# EAGLE design passlight (EAGLE 9.5.2)
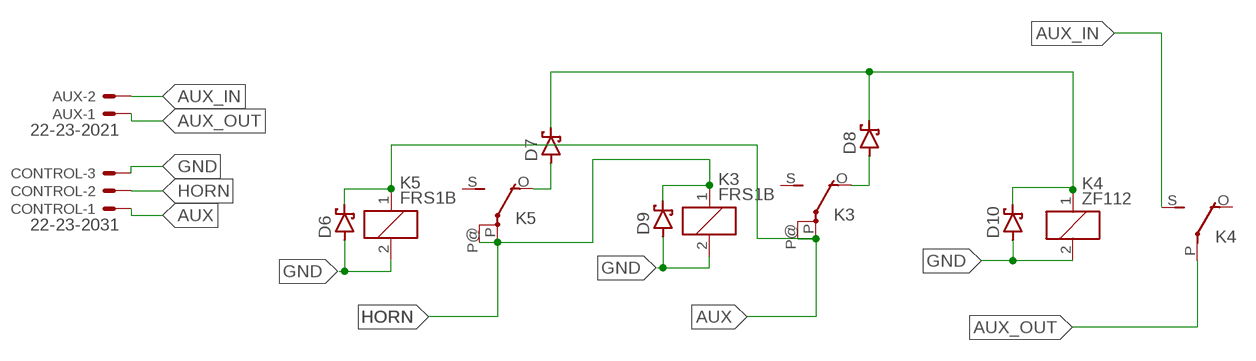
[diagram p0: schematic, sheet 1]

## Parts
AUX  22-23-2021  [22-23-2021]
CONTROL  22-23-2031  [22-23-2031]
D6  SCHOTTKY-DIODESMD  [SMB]
D7  SCHOTTKY-DIODESMD  [SMB]
D8  SCHOTTKY-DIODESMD  [SMB]
D9  SCHOTTKY-DIODESMD  [SMB]
D10  SCHOTTKY-DIODESMD  [SMB]
K3  FRS1B  [FRS1B]
K4  ZF112  [ZF112]
K5  FRS1B  [FRS1B]

## Nets
AUX: CONTROL.1 D6.C K3.P(2:P) K3.P@(2:P) K5.1
AUX_IN: AUX.2 K4.S(2:S)
AUX_OUT: AUX.1 K4.P(2:P)
GND: CONTROL.3 D6.A D9.A D10.A K3.2 K4.2 K5.2
HORN: CONTROL.2 D9.C K3.1 K5.P(2:P) K5.P@(2:P)
N$1: D7.A K5.O(2:O)
N$2: D8.A K3.O(2:O)
N$3: D7.C D8.C D10.C K4.1
Unconnected: K3.S(2:S) K4.O(2:O) K5.S(2:S)

## Library data of the parts
AUX = con-molex:22-23-2021: .100" (2.54mm) Center Header - 2 Pin; MF: MOLEX; MPN: 22-23-2021; OC_FARNELL: 1462926; OC_NEWARK: 25C3832
CONTROL = con-molex:22-23-2031: .100" (2.54mm) Center Header - 3 Pin; MF: MOLEX; MPN: 22-23-2031; OC_FARNELL: 1462950; OC_NEWARK: 30C0862
D6-D10 = diode:SCHOTTKY-DIODE: Schottky Diode
K3 K5 = relay:FRS1B: RELAY 1 x switch, same as V23101-D6-A201, Siemens; OC_FARNELL: unknown; OC_NEWARK: unknown
K4 = relay:ZF112: RELAY 1 x switch; OC_FARNELL: unknown; OC_NEWARK: unknown

## Board
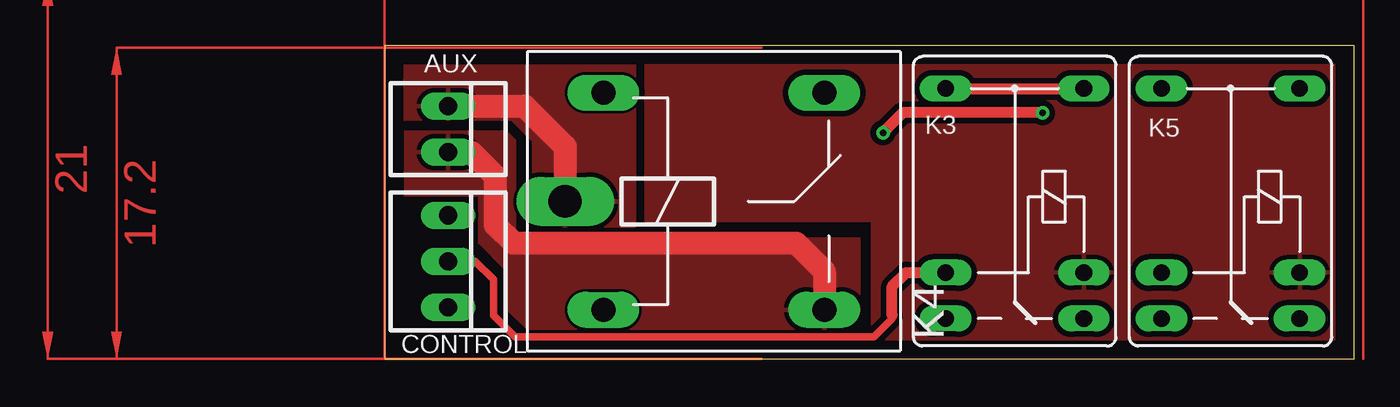
[diagram p1: board, top side]
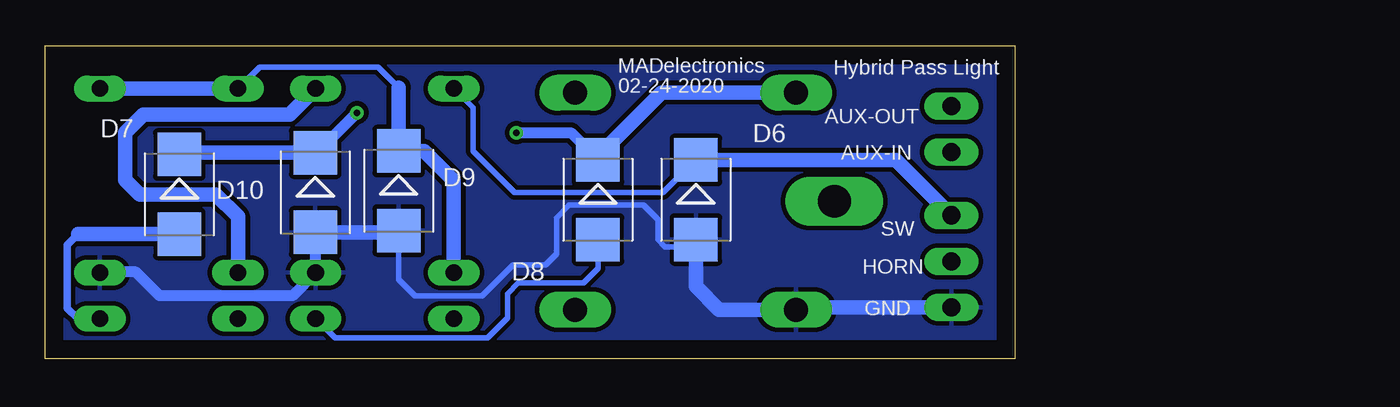
[diagram p2: board, bottom side, seen from below]

Size 53.5 x 17.3 mm. Coordinates in mm from the lower left corner, seen from the top.
Outline: 0,0 53.5,0 53.5,17.3 0,17.3 0,0
Copper layers (1*16): Top 0.035mm / dielectric 1.5mm / Bottom 0.035mm
Design rules "default": minimum track width 6mil, minimum drill 0.35mm, track to track 6mil, track to pad 6mil, pad to pad 6mil, via to via 6mil, smd to smd 6mil, copper to edge 40mil, drill to drill 6mil, minimum pad ring 10mil, minimum via ring 8mil, stop-mask expansion 4mil, vias tented up to drill 0mil, thermal gap 10mil

### Footprints (pad centres in the part's own frame; a part is rotated, then mirrored left to right if it is on the bottom)
22-23-2021 = drill 1 long: 1 -1.27,0; 2 1.27,0
22-23-2031 = drill 1 long: 1 -2.54,0; 2 0,0; 3 2.54,0
SMB = smd 2.4 x 2.4: A 2.2,0; C -2.2,0
FRS1B = drill 0.914 long: 1 0,3.81; 2 0,-3.81; O -2.54,-3.81; P 10.16,3.81; P@ 10.16,-3.81; S -2.54,3.81
ZF112 = drill 1.321 long: 1 -6.096,5.994; 2 -6.096,-5.994; O 6.096,5.994; S 6.096,-5.994 | drill 1.803 long: P -8.204,0

### Placement (x,y rotation side)
AUX  3.5,12.7 270 top
CONTROL  3.5,5.4 270 top
D6  17.6,8.8 270 bottom
D7  46.1,9.1 270 bottom
D8  23,8.8 270 bottom
D9  34,9.3 270 bottom
D10  38.6,9.2 270 bottom
K3  34.77,4.78 90 top
K4  18.16,8.71 0 top
K5  46.68,4.78 90 top

### Tracks (layer width: path | path; a pad name or v marks a point on that pad's centre or on a via)
AUX
  Top 0.61: K3.P K3.P@
  Bottom 0.305: K3.P 29.9,13.88 29.9,11.5 27.6,9.2 24.33,9.2 19.41,9.2 D6.C
  Bottom 0.813: CONTROL.1 6.56,11 D6.C | K3.P@ 40.02,13.5 48.1,13.5 49.1,12.5 49.1,9.9 48.3,9.1 44.1,9.1 42.87,7.87 K5.1
AUX_IN
  Top 1.27: AUX.2 4.77,11.43 6.1,10.1 6.1,7.4 7.1,6.4 22.7,6.4 24.26,4.84 K4.S
  pour Top: 0.5,12.6 6.7,12.6 7.2,12.1 7.2,6.7 26.2,6.7 26.2,1.6 7.9,1.6 6.7,2.8 6.7,4.9 5.2,6.4 5.2,9 0.5,9
AUX_OUT
  Top 1.27: AUX.1 7.73,13.97 9.96,11.74 K4.P
  pour Top: 0.4,13.2 0.4,16.8 13.8,16.8 13.8,7.3 8.2,7.3 8.2,12 7,13.2
GND
  Bottom 0.305: 34.1,7 D9.A 34,4.4 33.1,3.5 29.4,3.5 27.7,5.2 25.9,5.2 25.3,5.8 25.3,7.8 24.6,8.5 20.5,8.5 19.7,7.7 19.7,6.6 19.3,6.2 17.2,6.2 D6.A
  Bottom 0.61: D10.A 38.6,4.8 K3.2 39.86,3.5 47.2,3.5 48.5,4.8 50.47,4.8 K5.2
  Bottom 0.813: CONTROL.3 11.92,2.86 K4.2 16.32,2.72 17.6,4 D6.A | 34.1,7 D10.A
  pour Bottom (isolate 0.254): 0.2,17.1 53.3,17.1 53.3,0.1 0.2,0.1
  pour Top (isolate 0.305): 53.2,17 53.2,0.3 26.9,0.3 26.9,7.6 14.4,7.6 14.4,16.9 53.1,16.9
HORN
  Top 0.406: 28,2.42 28,2.22 27,1.22 7.18,1.22 6,2.4 6,4.4 5,5.4 CONTROL.2
  Top 0.61: 28,2.42 28,4 28.78,4.78 K3.1
  Bottom 0.305: 34,15 35.13,16.13 41.68,16.13 K5.P
  Bottom 0.813: K3.1 30.96,9.86 32.6,11.5 D9.C 34,15 | K5.P@ K5.P
N$1
  Bottom 0.406: K5.O 51.72,2.24 52.28,2.8 52.28,6.3 51.68,6.9
  Bottom 0.813: 51.68,6.9 D7.A
N$2
  Bottom 0.305: K3.O 37.51,1.17 29.1,1.17 28,2.27 28,3.6 27.4,4.2 23.8,4.2 23,5 D8.A
N$3  (via drill 0.35)
  Top 0.61: v36.3,13.6 28.6,13.6 v27.5,12.5
  Bottom 0.61: D10.C 38.5,11.4 v36.3,13.6 | v27.5,12.5 24.5,12.5 23.1,11.1 D8.C
  Bottom 0.813: K4.1 19.5,14.7 23.1,11.1 | D10.C 46,11.4 D7.C
(copper drawn outside any net)
  shapes: Top area x3

### Text on the board
bNames: Hybrid Pass Light | electronics | MAD | 02-24-2020 | AUX-OUT | AUX-IN | SW | HORN | GND